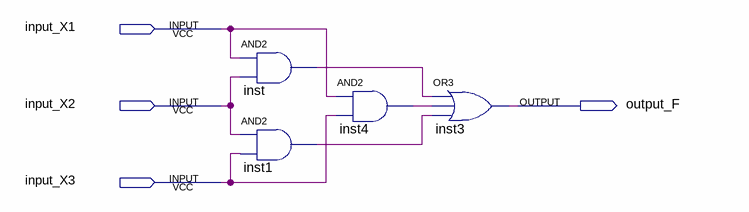
[diagram p0: schematic sheet]
// Quartus schematic main.bdf as structural Verilog: 4 symbols, 4 pins
module main (
  input  input_X1,
  input  input_X2,
  input  input_X3,
  output output_F
);

  wire inst1_out, inst4_out, inst_out;

  and inst (inst_out, input_X1, input_X2);
  and inst1 (inst1_out, input_X2, input_X3);
  and inst4 (inst4_out, input_X1, input_X3);
  or inst3 (output_F, inst_out, inst4_out, inst1_out);
endmodule
